# Altium project Sld_design_v1.PrjPcb
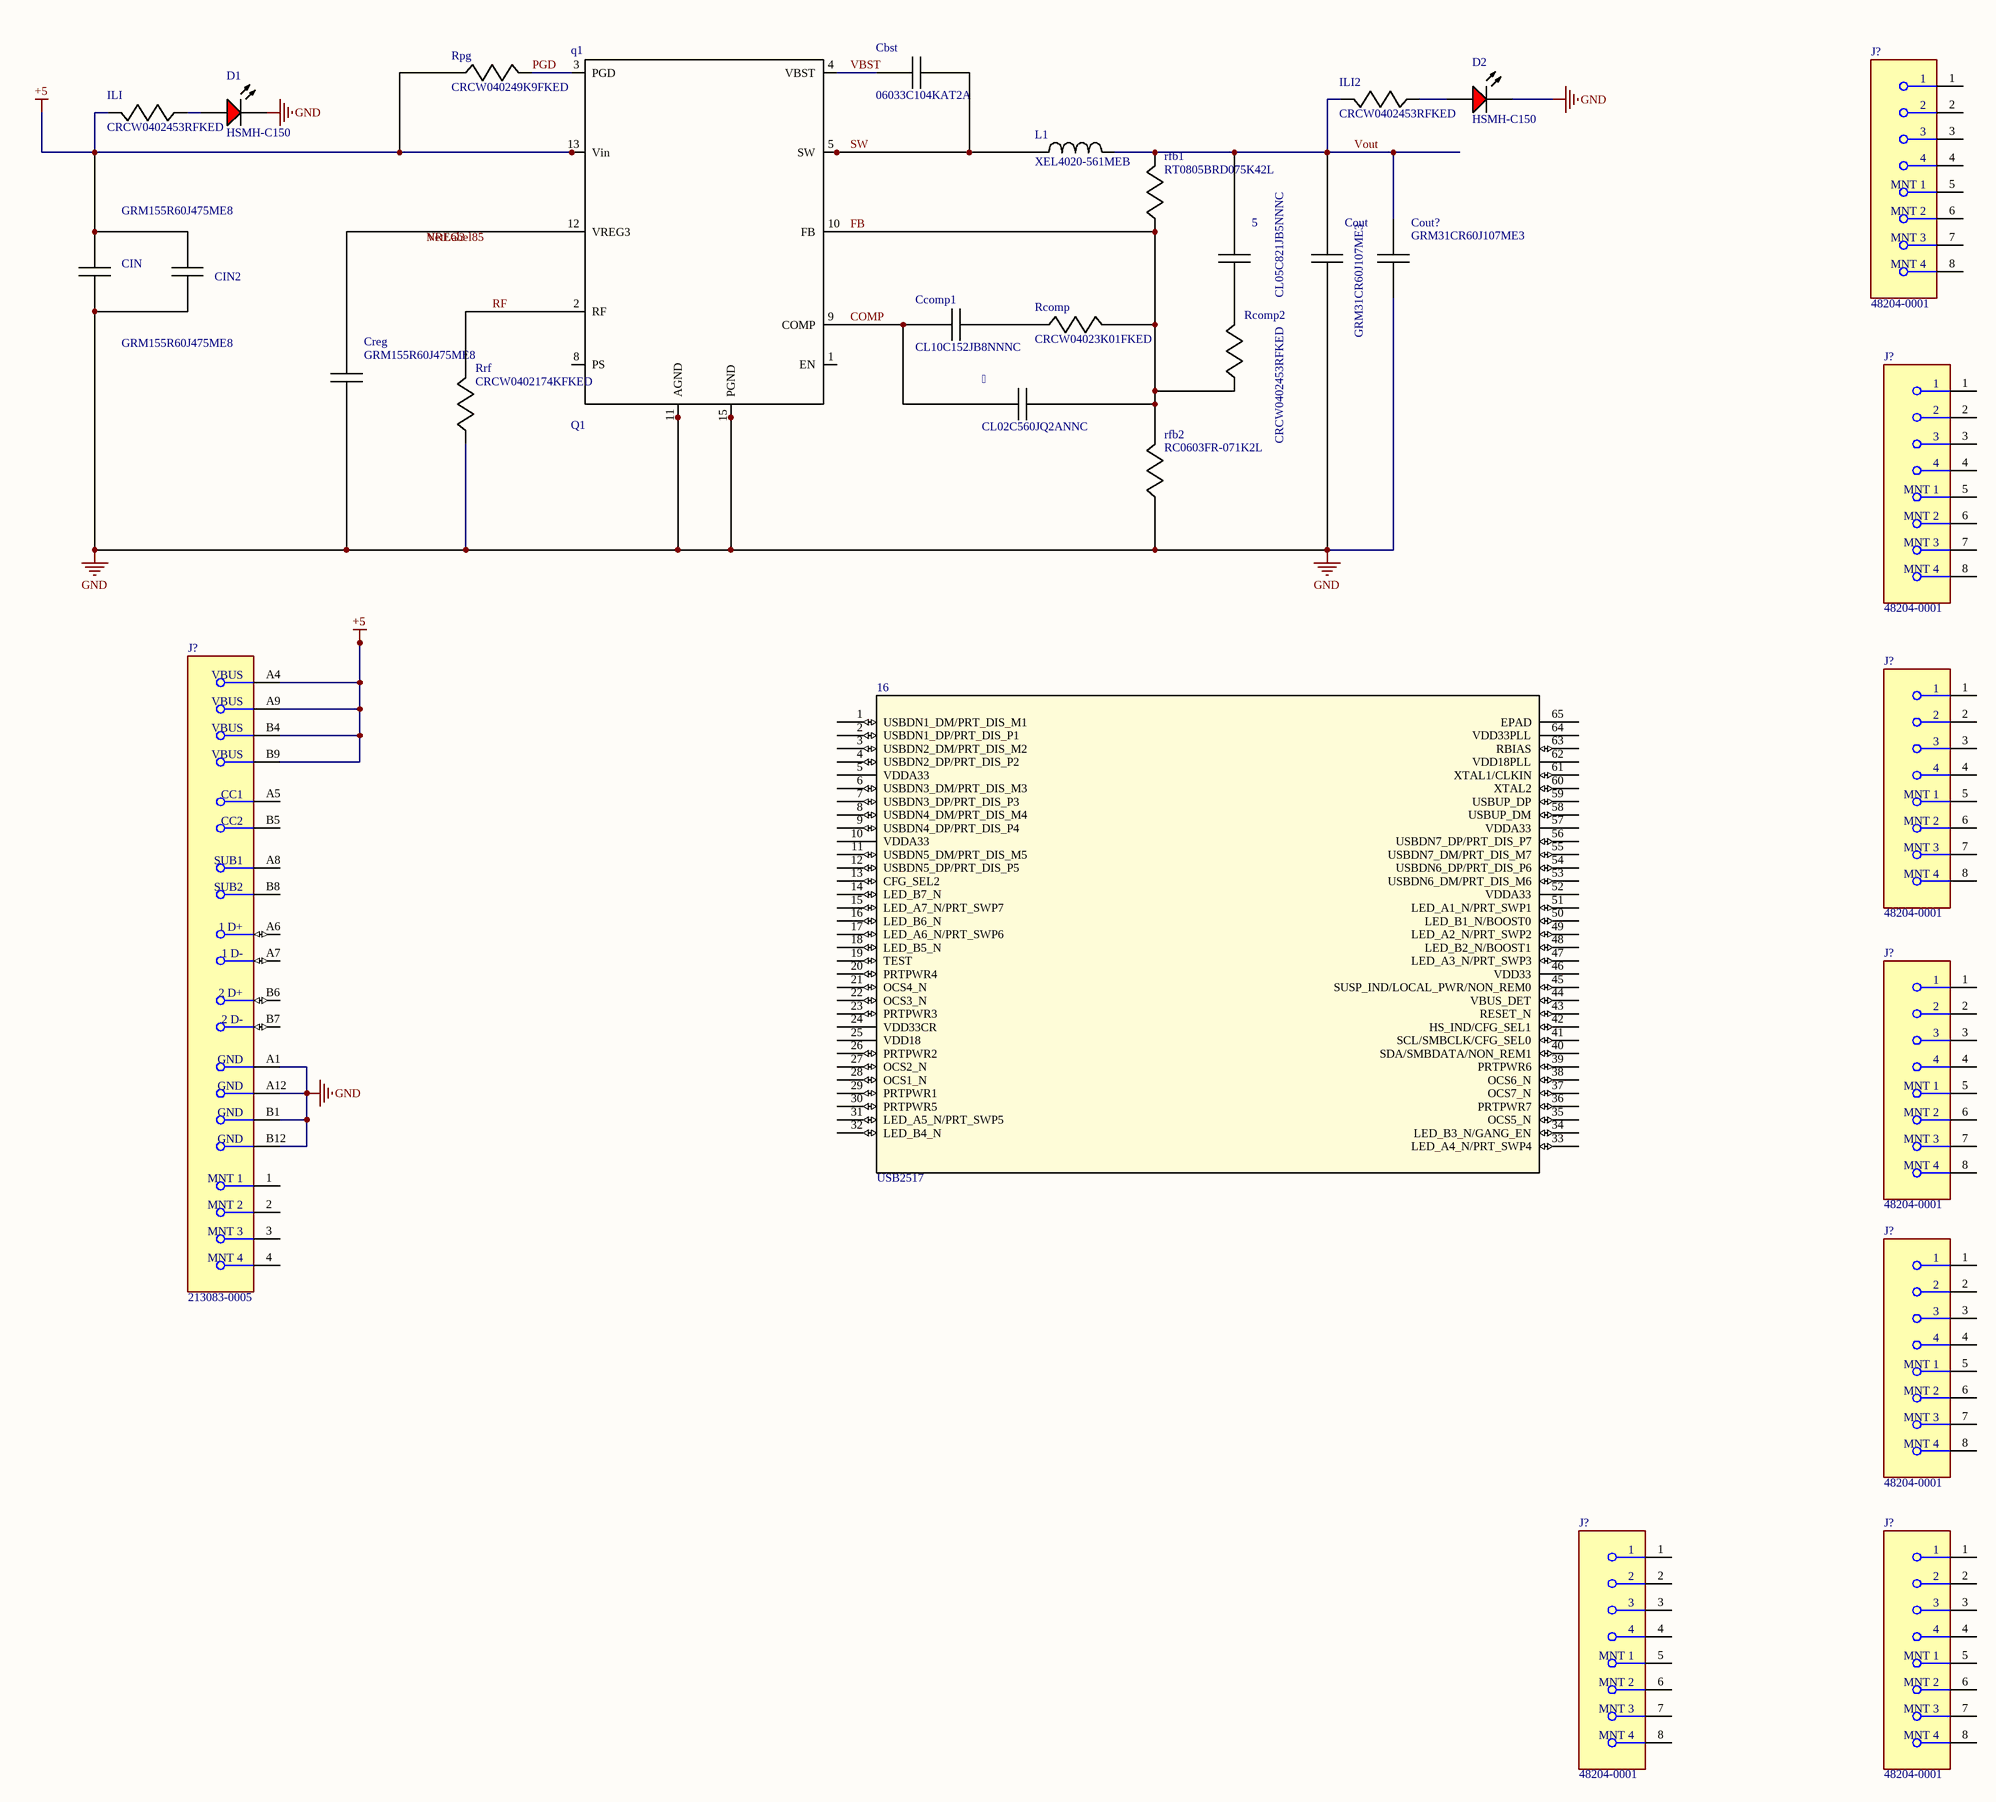
[diagram p0: sld_design_v1.SchDoc]
1 sheet, 30 parts. Net scope: global (net labels, ports and power ports of the same name join across sheets).
Board file: sld_design_v1.PcbDoc

## Sheet sld_design_v1.SchDoc
size C; SheetNumber: 1; SheetTotal: 1

### Parts
(Parts that share a designator on the sheet are numbered #1, #2 ... from top to bottom, then left to right.)
5  CL05C821JB5NNNC  [0402]
16  USB2517  [QFN64_9x9MC_MCH]
  CL02C560JQ2ANNC  [01005]
Cbst  06033C104KAT2A  [0603]
Ccomp1  CL10C152JB8NNNC  [0603]
CIN  GRM155R60J475ME8  [0402_065]
CIN2  GRM155R60J475ME8  [0402_065]
Cout  GRM31CR60J107ME3  [1206_190]
Cout?  GRM31CR60J107ME3  [1206_190]
Creg  GRM155R60J475ME8  [0402_065]
D1  HSMH-C150  [AVAG-HSMX-C150_V]
D2  HSMH-C150  [AVAG-HSMX-C150_V]
ILI  CRCW0402453RFKED  [0402]
ILI2  CRCW0402453RFKED  [0402]
J?#1  48204-0001  [FP-48204-0001-MFG]
J?#2  48204-0001  [FP-48204-0001-MFG]
J?#3  213083-0005  [FP-2130830005-MFG]
J?#4  48204-0001  [FP-48204-0001-MFG]
J?#5  48204-0001  [FP-48204-0001-MFG]
J?#6  48204-0001  [FP-48204-0001-MFG]
J?#7  48204-0001  [FP-48204-0001-MFG]
J?#8  48204-0001  [FP-48204-0001-MFG]
L1  XEL4020-561MEB  [XEL4020]
q1  Q1  [RGT0016C]
Rcomp  CRCW04023K01FKED  [0402]
Rcomp2  CRCW0402453RFKED  [0402]
rfb1  RT0805BRD075K42L  [0805]
rfb2  RC0603FR-071K2L  [0603]
Rpg  CRCW040249K9FKED  [0402]
Rrf  CRCW0402174KFKED  [0402]

### Nets
+5: CIN.1 CIN2.1 ILI.1 J?#3.A4(VBUS) J?#3.A9(VBUS) J?#3.B4(VBUS) J?#3.B9(VBUS) q1.13(Vin) q1.14(Vin) Rpg.2
GND: CIN.2 CIN2.2 Cout.2 Cout?.2 Creg.2 D1.2(K) D2.2(K) J?#3.A1(GND) J?#3.A12(GND) J?#3.B1(GND) J?#3.B12(GND) q1.11(AGND) q1.15(PGND) q1.16(PGND) q1.17(AGND) rfb2.2 Rrf.2
COMP: .2 Ccomp1.2 q1.9(COMP)
FB: .1 q1.10(FB) Rcomp.1 Rcomp2.2 rfb1.2 rfb2.1
PGD: q1.3(PGD) Rpg.1
RF: q1.2(RF) Rrf.1
SW: Cbst.1 L1.2 q1.5(SW) q1.6(SW) q1.7(SW)
VBST: Cbst.2 q1.4(VBST)
Vout: 5.1 Cout.1 Cout?.1 ILI2.1 L1.1 rfb1.1
Net5_2: 5.2 Rcomp2.1
NetCcomp1_1: Ccomp1.1 Rcomp.2
NetCreg_1: Creg.1 q1.12(VREG3)
NetD1_1: D1.1(A) ILI.2
NetD2_1: D2.1(A) ILI2.2

Not connected (* = marked no-connect by the designer): 16 1(USBDN1_DM/PRT_DIS_M1) 2(USBDN1_DP/PRT_DIS_P1) 3(USBDN2_DM/PRT_DIS_M2) 4(USBDN2_DP/PRT_DIS_P2) 5(VDDA33) 6(USBDN3_DM/PRT_DIS_M3) 7(USBDN3_DP/PRT_DIS_P3) 8(USBDN4_DM/PRT_DIS_M4) 9(USBDN4_DP/PRT_DIS_P4) 10(VDDA33) 11(USBDN5_DM/PRT_DIS_M5) 12(USBDN5_DP/PRT_DIS_P5) 13(CFG_SEL2) 14(LED_B7_N) 15(LED_A7_N/PRT_SWP7) 16(LED_B6_N) 17(LED_A6_N/PRT_SWP6) 18(LED_B5_N) 19(TEST) 20(PRTPWR4) 21(OCS4_N) 22(OCS3_N) 23(PRTPWR3) 24(VDD33CR) 25(VDD18) 26(PRTPWR2) 27(OCS2_N) 28(OCS1_N) 29(PRTPWR1) 30(PRTPWR5) 31(LED_A5_N/PRT_SWP5) 32(LED_B4_N) 33(LED_A4_N/PRT_SWP4) 34(LED_B3_N/GANG_EN) 35(OCS5_N) 36(PRTPWR7) 37(OCS7_N) 38(OCS6_N) 39(PRTPWR6) 40(SDA/SMBDATA/NON_REM1) 41(SCL/SMBCLK/CFG_SEL0) 42(HS_IND/CFG_SEL1) 43(RESET_N) 44(VBUS_DET) 45(SUSP_IND/LOCAL_PWR/NON_REM0) 46(VDD33) 47(LED_A3_N/PRT_SWP3) 48(LED_B2_N/BOOST1) 49(LED_A2_N/PRT_SWP2) 50(LED_B1_N/BOOST0) 51(LED_A1_N/PRT_SWP1) 52(VDDA33) 53(USBDN6_DM/PRT_DIS_M6) 54(USBDN6_DP/PRT_DIS_P6) 55(USBDN7_DM/PRT_DIS_M7) 56(USBDN7_DP/PRT_DIS_P7) 57(VDDA33) 58(USBUP_DM) 59(USBUP_DP) 60(XTAL2) 61(XTAL1/CLKIN) 62(VDD18PLL) 63(RBIAS) 64(VDD33PLL) 65(EPAD); J?#1 1 2 3 4 5(MNT_1) 6(MNT_2) 7(MNT_3) 8(MNT_4); J?#2 1 2 3 4 5(MNT_1) 6(MNT_2) 7(MNT_3) 8(MNT_4); J?#3 1(MNT_1) 2(MNT_2) 3(MNT_3) 4(MNT_4) A5(CC1) A6(1_D+) A7(1_D-) A8(SUB1) B5(CC2) B6(2_D+) B7(2_D-) B8(SUB2); J?#4 1 2 3 4 5(MNT_1) 6(MNT_2) 7(MNT_3) 8(MNT_4); J?#5 1 2 3 4 5(MNT_1) 6(MNT_2) 7(MNT_3) 8(MNT_4); J?#6 1 2 3 4 5(MNT_1) 6(MNT_2) 7(MNT_3) 8(MNT_4); J?#7 1 2 3 4 5(MNT_1) 6(MNT_2) 7(MNT_3) 8(MNT_4); J?#8 1 2 3 4 5(MNT_1) 6(MNT_2) 7(MNT_3) 8(MNT_4); q1 1(EN) 8(PS)

### Library data of the parts
5 = CL05C821JB5NNNC: No Description Available; Vendor: Samsung Electro-Mechanics; Manufacturer_Part_Number: CL05C821JB5NNNC; Manufacturer_Name: Samsung Electro-Mechanics; Copyright: Copyright (C) 2018 Accelerated Designs. All rights reserved; RefDes: RefDes; TYPE: TYPE; Value: Value
16 = USB2517: The 7-Port Hub is a low power, OEM configurable, MTT / (multi transaction translator) hub controller IC with 7 / downstream ports for embedded USB solutions. The 7- / port hub is fully compliant with the USB 2.0 Specifica- / tion and will attach to an upstream port as a Full-Speed / Hub or as a Full-/Hi-Speed Hub. The 7-Port Hub sup- / ports Low-Speed, Full-Speed, and Hi-Speed (if operat- / ing as a Hi-Speed Hub) downstream devices on all of / the enabled downstream ports.
 = CL02C560JQ2ANNC: No Description Available; Vendor: Samsung Electro-Mechanics; Manufacturer_Part_Number: CL02C560JQ2ANNC; Manufacturer_Name: Samsung Electro-Mechanics; Copyright: Copyright (C) 2018 Accelerated Designs. All rights reserved; RefDes: RefDes; TYPE: TYPE; Value: Value
Cbst = 06033C104KAT2A: No Description Available; Vendor: AVX; Manufacturer_Part_Number: 06033C104KAT2A; Manufacturer_Name: AVX; Copyright: Copyright (C) 2018 Accelerated Designs. All rights reserved; RefDes: RefDes; TYPE: TYPE; Value: Value
Ccomp1 = CL10C152JB8NNNC: No Description Available; Vendor: Samsung Electro-Mechanics; Manufacturer_Part_Number: CL10C152JB8NNNC; Manufacturer_Name: Samsung Electro-Mechanics; Copyright: Copyright (C) 2018 Accelerated Designs. All rights reserved; RefDes: RefDes; TYPE: TYPE; Value: Value
CIN CIN2 Creg = GRM155R60J475ME8: No Description Available; Manufacturer_Part_Number: GRM155R60J475ME87D; Vendor: MuRata; Manufacturer_Name: MuRata; Copyright: Copyright (C) 2018 Accelerated Designs. All rights reserved; RefDes: RefDes; TYPE: TYPE; Value: Value
Cout Cout? = GRM31CR60J107ME3: No Description Available; Manufacturer_Part_Number: GRM31CR60J107ME39L; Vendor: MuRata; Manufacturer_Name: MuRata; Copyright: Copyright (C) 2018 Accelerated Designs. All rights reserved; RefDes: RefDes; TYPE: TYPE; Value: Value
D1 D2 = CMP-2000-06426-1: LED Uni-Color Red, 65 mW, 25 mA, -40 to 85 degC, 2-Pin SMD, RoHS, Tape and Reel; Manufacturer: Avago; Product Height (mm): 1.1mm; Power Dissipation: 78W; Product Length (mm): 3.2mm; Forward Voltage: 2.6V; Luminous Intensity: 17mcd; DELETED: Compliant; Shape Type: Rectangular; Peak Wavelength: 660nm; Main Category: ChipLED; Dominant Wave Length: 639nm; Rad Hardened: No; Lens Type: ColorlessDiffused; Product Depth (mm): 1.6mm; Reverse Voltage: 5V; Forward Current: 25mA; Chip Material: GaAlAs; Test Current (It): 20mA; Viewing Angle: 170deg; Number of  Elements: 1; Type: Uni-Color; Package Reference: HSMX-C150; Package Description: 2-Pin Surface Mount Device, Body 3.2 x 1.6 mm; Operating Temp Range: -40Cto85C; Mounting: SurfaceMount; Emitting Color: Red; Pin Count: 2; Operating Temperature Classification: Industrial; Datasheet URL: http://media.digikey.com/pdf/Data%20Sheets/Avago%20PDFs/HSMz-Czzz.pdf; Package Type: ChipLed; Mounting Technology: SurfaceMount; High Brightness: No; Lens Dimensions: 2x1.6x0.6mm; Manufacturer URL: http://www.avagotech.com/; Lum Intensity: 17mcd; Datasheet Version: 03/2012; Packaging: TapeandReel
ILI ILI2 Rcomp2 = CRCW0402453RFKED: No Description Available; Vendor: Vishay-Dale; Manufacturer_Part_Number: CRCW0402453RFKED; Manufacturer_Name: Vishay-Dale; Copyright: Copyright (C) 2018 Accelerated Designs. All rights reserved; RefDes: RefDes; TYPE: TYPE; Value: Value
J?#1 J?#2 J?#4-J?#8 = CMP-0411-00001-3: CONN RCPT USB2.0 TYPEA 4POS R/A; Max Voltage Rating (DC): 3.03kV; Number of Contacts: 4; Current Rating: 1.5A; Voltage Rating: 30V; Connector Type: USB; Insulation Resistance: 1GR; Number of Ports: 1; Gender: Female; Pitch: 2mm; Min Operating Temperature: -55°C; Series: 48204; Number of Rows: 3; Length: 7.2mm; Package Quantity: 60; Contact Plating: Bronze; Termination: Solder; Voltage Rating (AC): 30V; Max Voltage Rating (AC): 30V; Depth: 19.25mm; Number of Circuits: 4; Flammability Rating: UL94 V-0; Contact Material: Tin; Housing Material: Polyester; Packaging: Tray; Color: Black; Orientation: Right Angle; Radiation Hardening: No; Number of Terminals/Pins: 4; Features: Shielded; Max Operating Temperature: 85°C; Weight: 0.09524oz
J?#3 = CMP-04767-000030-2: CONN RCP USB2.0 TYP C 24P SMD RA; NexarPartId: 114105384; Current Rating: 5A; Number of Contacts: 16; Voltage Rating: 30V; Gender: Receptacle; Min Operating Temperature: -40°C; USB Standard: USB 2.0; Max Operating Temperature: 85°C; Contact Material: Gold, Nickel; Schedule B: 8536695050, 8536695050; Country of Origin: CN
L1 = XEL4020-561MEB: 560nH; Vendor: Coilcraft; Manufacturer_Part_Number: XEL4020-561MEB; Manufacturer_Name: Coilcraft; Copyright: Copyright (C) 2018 Accelerated Designs. All rights reserved; RefDes: RefDes; TYPE: TYPE; Value: Value
q1 = TPS53316RGTR: No Description Available; Vendor: Texas Instruments; Manufacturer_Part_Number: TPS53316RGTR; Manufacturer_Name: Texas Instruments; Copyright: Copyright (C) 2018 Accelerated Designs. All rights reserved; RefDes: RefDes; TYPE: TYPE; Value: Value
Rcomp = CRCW04023K01FKED: No Description Available; Vendor: Vishay-Dale; Manufacturer_Part_Number: CRCW04023K01FKED; Manufacturer_Name: Vishay-Dale; Copyright: Copyright (C) 2018 Accelerated Designs. All rights reserved; RefDes: RefDes; TYPE: TYPE; Value: Value
rfb1 = RT0805BRD075K42L: No Description Available; Manufacturer_Name: Yageo; Vendor: Yageo America; Manufacturer_Part_Number: RT0805BRD075K42L; Copyright: Copyright (C) 2018 Accelerated Designs. All rights reserved; RefDes: RefDes; TYPE: TYPE; Value: Value
rfb2 = RC0603FR-071K2L: No Description Available; Manufacturer_Name: Yageo; Vendor: Yageo America; Manufacturer_Part_Number: RC0603FR-071K2L; Copyright: Copyright (C) 2018 Accelerated Designs. All rights reserved; RefDes: RefDes; TYPE: TYPE; Value: Value
Rpg = CRCW040249K9FKED: No Description Available; Manufacturer_Name: Vishay-Dale; Res_ohm: 49900; Power_W: 0.063; PartNumber: CRCW040249K9FKED; Manufacturer_Part_Number: CRCW040249K9FKED; Copyright: Copyright (C) 2018 Accelerated Designs. All rights reserved; RefDes: RefDes; TYPE: TYPE; Value: Value
Rrf = CRCW0402174KFKED: No Description Available; Vendor: Vishay-Dale; Manufacturer_Part_Number: CRCW0402174KFKED; Manufacturer_Name: Vishay-Dale; Copyright: Copyright (C) 2018 Accelerated Designs. All rights reserved; RefDes: RefDes; TYPE: TYPE; Value: Value